# Altium project V2.3SB_Chipsat_Mark.PrjPcb
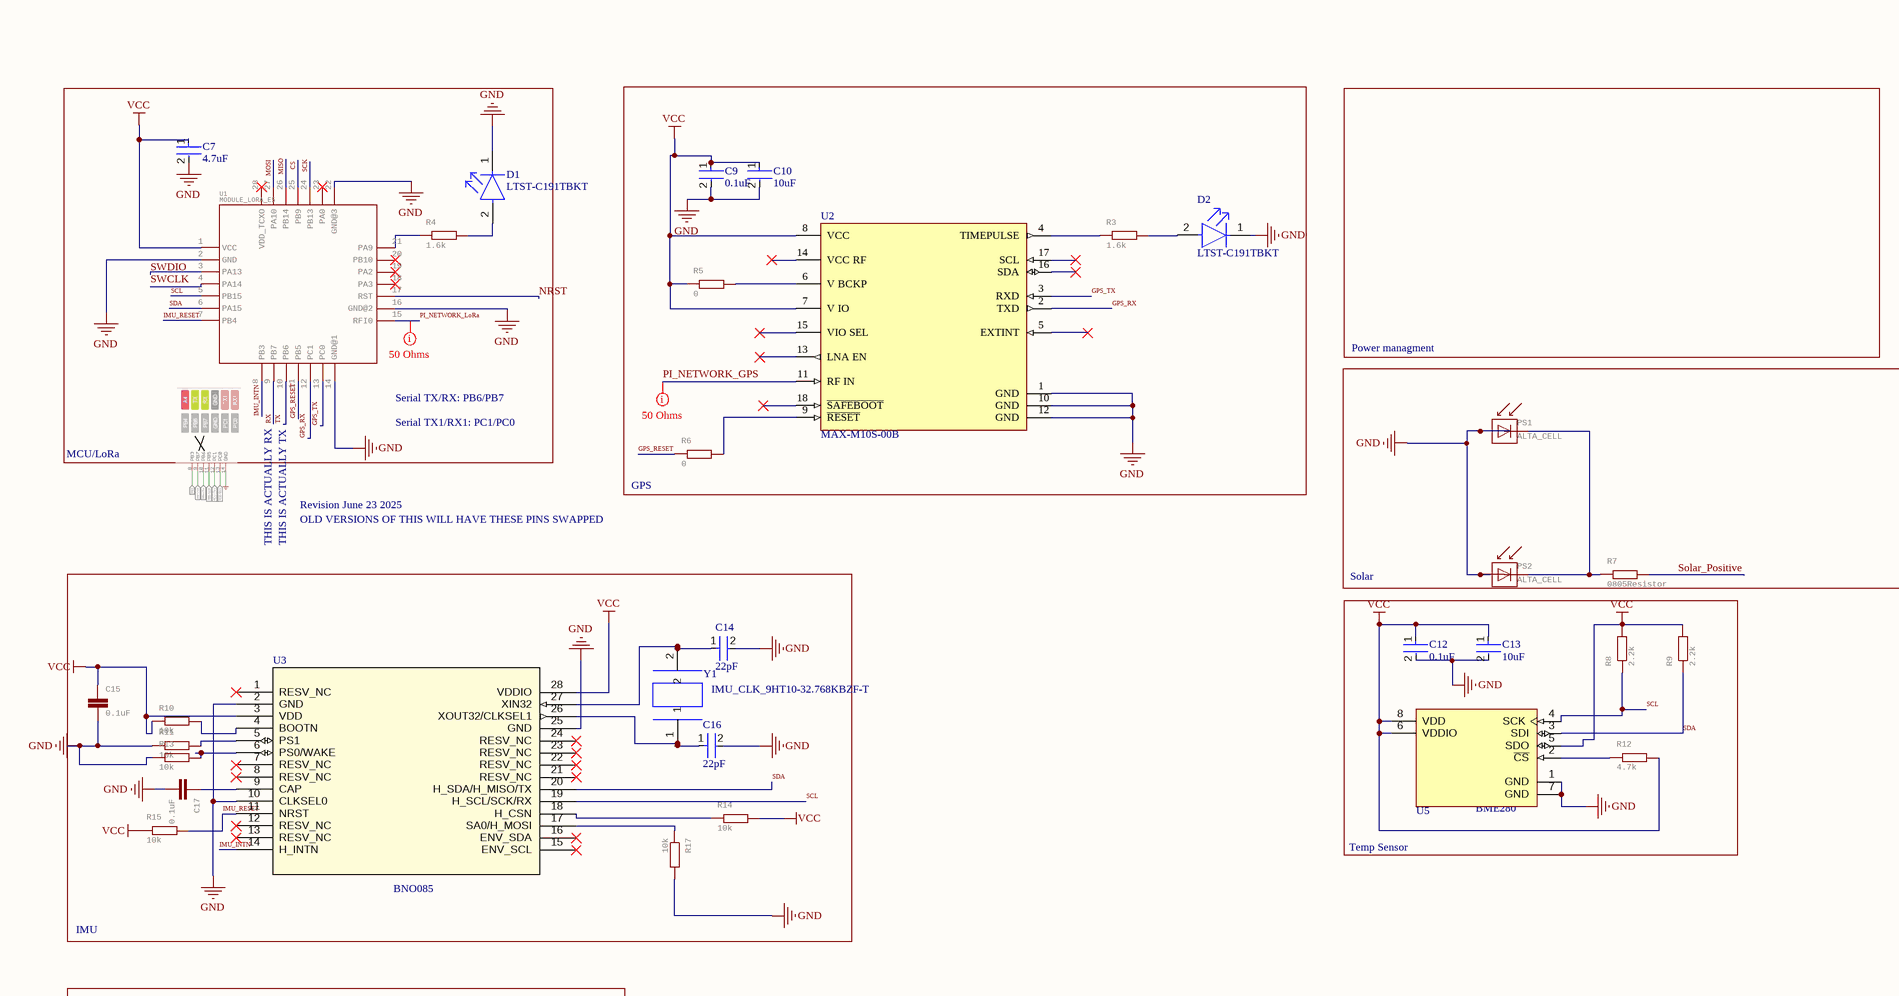
[diagram p0: V2.3SB.SchDoc, top left]
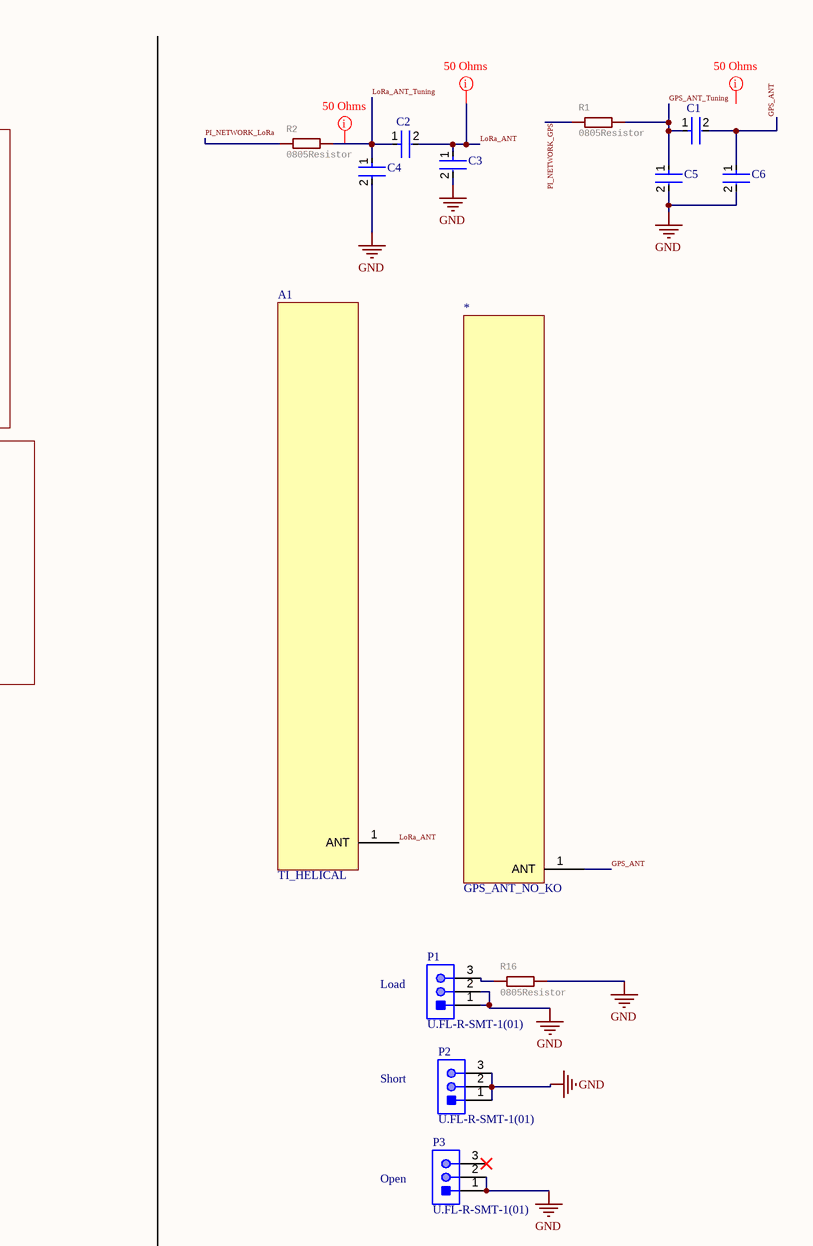
[diagram p1: V2.3SB.SchDoc, top right]
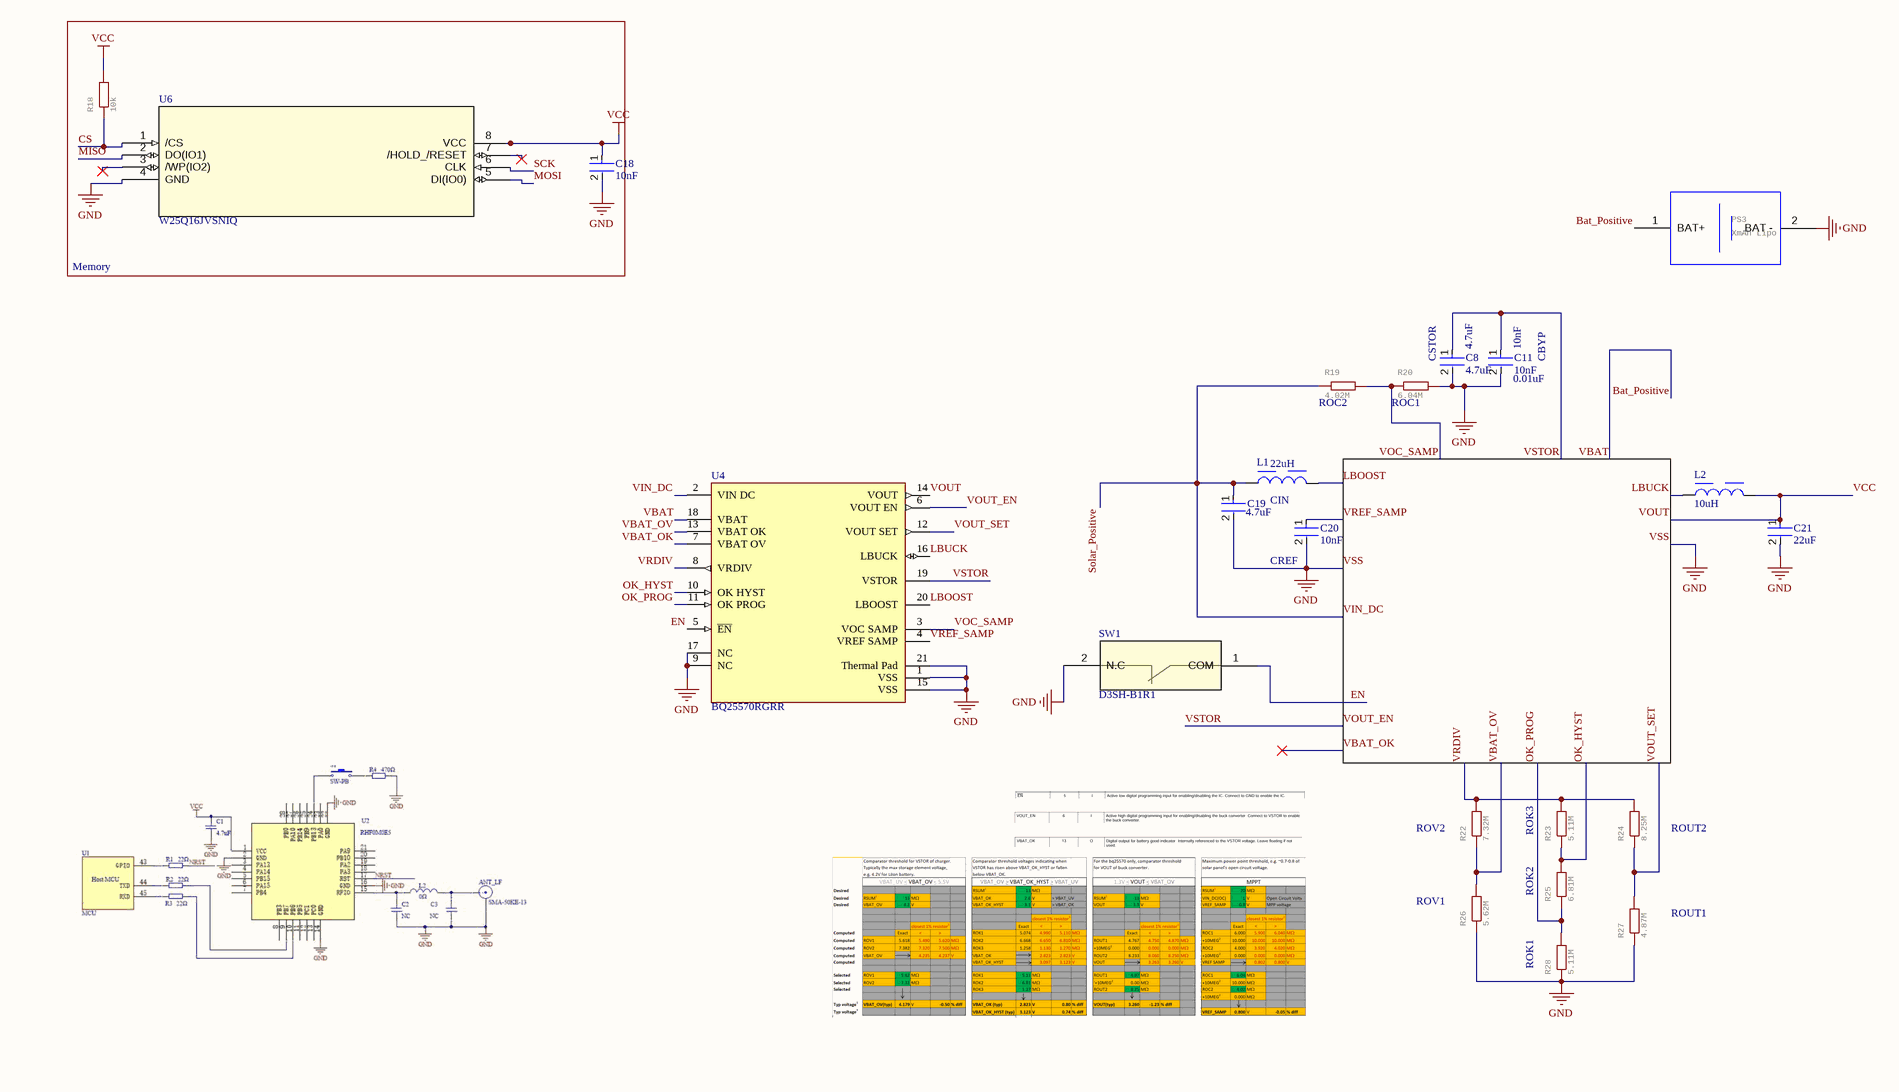
[diagram p2: V2.3SB.SchDoc, bottom left]
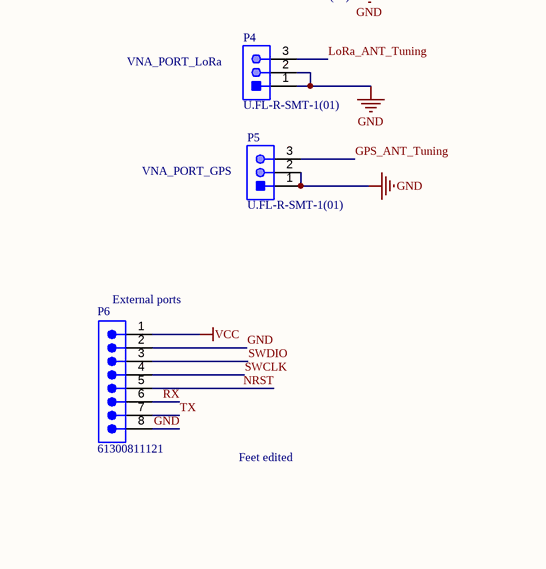
[diagram p3: V2.3SB.SchDoc, bottom right]
1 sheet, 71 parts. Net scope: global (net labels, ports and power ports of the same name join across sheets).
Board file: V2.3SB.PcbDoc

## Sheet V2.3SB.SchDoc
size 558 x 431 mm; SheetNumber: 1; SheetTotal: 1

### Parts
*  GPS_ANT_NO_KO  [GPS_ANT_NO_KO]
A1  TI_HELICAL  [TI_HELICAL]
C1  C0402C223K8PACTU  [PI_NET_CAPACITOR_0805]  (value not drawn)
C2  C0402C223K8PACTU  [PI_NET_CAPACITOR_0805]  (value not drawn)
C3  C0402C223K8PACTU  [PI_NET_CAPACITOR_0805]  (value not drawn)
C4  C0402C223K8PACTU  [PI_NET_CAPACITOR_0805]  (value not drawn)
C5  C0402C223K8PACTU  [PI_NET_CAPACITOR_0805]  (value not drawn)
C6  C0402C223K8PACTU  [PI_NET_CAPACITOR_0805]  (value not drawn)
C7  4.7uF  [0402CAP]
C8  4.7uF  [0402CAP]
C9  0.1uF  [0402CAP]
C10  10uF  [0402CAP]
C11  10nF  [0402CAP]
C12  0.1uF  [0402CAP]
C13  10uF  [0402CAP]
C14  22pF  [0402CAP]
C15  0.1uF  [0402]
C16  22pF  [0402CAP]
C17  0.1uF  [0402]
C18  10nF  [0402CAP]
C19  4.7uF  [0402CAP]  (value not drawn)
C20  10nF  [0402CAP]
C21  22uF  [0402CAP]
D1  LTST-C191TBKT  [0805LED]
D2  LTST-C191TBKT  [0805LED]
L1  22uH  [Inductor_Boost_BQ25570]
L2  10uH  [Inductor_Buck_BQ25570]
P1  U.FL-R-SMT-1(01)  [UFL]
P2  U.FL-R-SMT-1(01)  [UFL]
P3  U.FL-R-SMT-1(01)  [UFL]
P4  U.FL-R-SMT-1(01)  [UFL]
P5  U.FL-R-SMT-1(01)  [UFL]
P6  61300811121  [8pinhead Slightly wider]
PS1  ALTA_CELL  [ALTA_CELL_SAME_SIZED_FEET_SLIM]
PS2  ALTA_CELL  [ALTA_CELL_SAME_SIZED_FEET_SLIM]
PS3  XmAh Lipo  [BAT_PADS]
R1  0805Resistor  [0805Res]
R2  0805Resistor  [0805Res]
R3  1.6k  [0402]
R4  1.6k  [0402]
R5  0  [0402]
R6  0  [0402]
R7  0805Resistor  [0805Res]
R8  2.2k  [0402]
R9  2.2k  [0402]
R10  10k  [0402]
R11  10k  [0402]
R12  4.7k  [0402]
R13  10k  [0402]
R14  10k  [0402]
R15  10k  [0402]
R16  0805Resistor  [0805Res]
R17  10k  [0402]
R18  10k  [0402]
R19  4.02M  [0402]
R20  6.04M  [0402]
R22  7.32M  [0402]
R23  5.11M  [0402]
R24  8.25M  [0402]
R25  6.81M  [0402]
R26  5.62M  [0402]
R27  4.87M  [0402]
R28  5.11M  [0402]
SW1  D3SH-B1R1  [Micro_Trigger_Switch_Long_D3SH-B1R1]
U1  MODULE_LORA_E5  [MODULE28P-1-25-12X12X2-5MM]
U2  MAX-M10S-00B  [GPS_MAX_10]
U3  BNO085  [QFN28_BNO086_CEV]
U4  BQ25570RGRR  [BQ25570_With_Vias]
U5  BME280  [FP-BME280-MFG]  (value not drawn)
U6  W25Q16JVSNIQ  [SOIC_150MIL_WIN]
Y1  IMU_CLK_9HT10-32.768KBZF-T  [IMU_CLK_XTAL320X150X75]

### Blocks framed on the sheet
GPS: C9 C10 D2 R3 R5 R6 U2
IMU: C14-C17 R10 R11 R13-R15 R17 U3 Y1
Memory: C18 R18 U6

### Nets
GND: C3.2 C4.2 C5.2 C6.2 C7.2 C8.2 C9.2 C10.2 C11.2 C12.2 C13.2 C14.2 C15.2 C16.2 C17.2 C18.2 C19.2 C20.2 C21.2 D1.1(C) D2.1(C) P1.1 P1.2 P2.1 P2.2 P2.3 P3.1 P3.2 P4.1 P4.2 P5.1 P5.2 P6.2 P6.8 PS1.- PS2.- PS3.2(BAT_-) R11.1 R13.1 R16.2 R17.2 R20.2 R26.1 R27.1 R28.1 SW1.2(N.C) U1.2(GND) U1.14(GND@1) U1.16(GND@2) U1.22(GND@3) U2.1(GND) U2.10(GND) U2.12(GND) U3.2(GND) U3.10(CLKSEL0) U3.25(GND) U4.1(VSS) U4.9(NC) U4.15(VSS) U4.17(NC) U4.21(Thermal_Pad) U5.1(GND) U5.7(GND) U6.4(GND)  [also labelled VSS]
VCC: C7.1 C9.1 C10.1 C12.1 C13.1 C15.1 C18.1 C21.1 L2.2 P6.1 R5.1 R8.2 R9.2 R10.1 R12.2 R14.2 R15.1 R18.2 U1.1(VCC) U2.7(V_IO) U2.8(VCC) U3.3(VDD) U3.28(VDDIO) U4.14(VOUT) U5.5(SDO) U5.6(VDDIO) U5.8(VDD) U6.8(VCC)  [also labelled VOUT]
Bat_Positive: PS3.1(BAT+) U4.18(VBAT)  [also labelled VBAT]
CS: R18.1 U1.25(PB9) U6.1(/CS)
EN: SW1.1(COM) U4.5(~{EN})
GPS_ANT: *.1(ANT) C1.2 C6.1
GPS_ANT_Tuning: C1.1 C5.1 P5.3 R1.2
GPS_RESET: R6.1 U1.11(PB5)
GPS_RX: U1.12(PC1) U2.2(TXD)
GPS_TX: U1.13(PC0) U2.3(RXD)
IMU_INTN: U1.8(PB3) U3.14(H_INTN)
IMU_RESET: R15.2 U1.7(PB4) U3.11(NRST)
LBOOST: L1.2 U4.20(LBOOST)
LBUCK: L2.1 U4.16(LBUCK)
LoRa_ANT: A1.1(ANT) C2.2 C3.1
LoRa_ANT_Tuning: C2.1 C4.1 P4.3 R2.2
MISO: U1.26(PB14) U6.2(DO(IO1))
MOSI: U1.27(PA10) U6.5(DI(IO0))
NRST: P6.5 U1.17(RST)
OK_HYST: R23.1 R25.2 U4.10(OK_HYST)
OK_PROG: R25.1 R28.2 U4.11(OK_PROG)
PI_NETWORK_GPS: R1.1 U2.11(RF_IN)
PI_NETWORK_LoRa: R2.1 U1.15(RFI0)
RX: P6.6 U1.9(PB7)
SCK: U1.24(PB13) U6.6(CLK)
SCL: R8.1 U1.5(PB15) U3.19(H_SCL/SCK/RX) U5.4(SCK)
SDA: R9.1 U1.6(PA15) U3.20(H_SDA/H_MISO/TX) U5.3(SDI)
Solar_Positive: C19.1 L1.1 R7.2 R19.1 U4.2(VIN_DC)  [also labelled VIN_DC]
SWCLK: P6.4 U1.4(PA14)
SWDIO: P6.3 U1.3(PA13)
TX: P6.7 U1.10(PB6)
VBAT_OK: U4.7(VBAT_OV)
VBAT_OV: R22.1 R26.2 U4.13(VBAT_OK)
VOC_SAMP: R19.2 R20.1 U4.3(VOC_SAMP)
VOUT_EN: C8.1 C11.1 U4.6(VOUT_EN) U4.19(VSTOR)  [also labelled VSTOR]
VOUT_SET: R24.1 R27.2 U4.12(VOUT_SET)
VRDIV: R22.2 R23.2 R24.2 U4.8(VRDIV)
VREF_SAMP: C20.1 U4.4(VREF_SAMP)
NetC14_1: C14.1 U3.27(XIN32) Y1.2
NetC16_1: C16.1 U3.26(XOUT32/CLKSEL1) Y1.1
NetC17_1: C17.1 U3.9(CAP)
NetD1_2: D1.2(A) R4.2
NetD2_2: D2.2(A) R3.2
NetP1_3: P1.3 R16.1
NetPS1_+: PS1.+ PS2.+ R7.1
NetR3_1: R3.1 U2.4(TIMEPULSE)
NetR4_1: R4.1 U1.21(PA9)
NetR5_2: R5.2 U2.6(V_BCKP)
NetR6_2: R6.2 U2.9(~{RESET})
NetR10_2: R10.2 U3.4(BOOTN)
NetR11_2: R11.2 U3.5(PS1)
NetR12_1: R12.1 U5.2(~{CS})
NetR13_2: R13.2 U3.6(PS0/WAKE)
NetR14_1: R14.1 U3.18(H_CSN)
NetR17_1: R17.1 U3.17(SA0/H_MOSI)

Not connected (* = marked no-connect by the designer): P3 3*; U1 18(PA3)* 19(PA2)* 20(PB10)* 23(PA0)* 28(VDD_TCXO)*; U2 5(EXTINT)* 13(LNA_EN)* 14(VCC_RF)* 15(VIO_SEL)* 16(SDA)* 17(SCL)* 18(~{SAFEBOOT})*; U3 1(RESV_NC)* 7(RESV_NC)* 8(RESV_NC)* 12(RESV_NC)* 13(RESV_NC)* 15(ENV_SCL)* 16(ENV_SDA)* 21(RESV_NC)* 22(RESV_NC)* 23(RESV_NC)* 24(RESV_NC)*; U6 3(/WP(IO2))* 7(/HOLD_/RESET)*

### Layout directives
rule Impedance Constraint [Min = 49.00    Max = 51.00    ]: (no net found under the mark), LoRa_ANT, LoRa_ANT_Tuning, PI_NETWORK_GPS, PI_NETWORK_LoRa

### Notes on the sheet
- Power managment
- (near U1) Serial TX/RX: PB6/PB7
- MCU/LoRa
- Serial TX1/RX1: PC1/PC0
- OLD VERSIONS OF THIS WILL HAVE THESE PINS SWAPPED
- Revision June 23 2025
- THIS IS ACTUALLY RX
- THIS IS ACTUALLY TX
- Solar
- (near U5) BME280
- Temp Sensor
- (near P1) Load
- Short
- Open
- VNA_PORT_LoRa
- VNA_PORT_GPS
- (near C8) CSTOR
- 4.7uF
- (near C11) 10nF
- (near C11) CBYP
- (near R19) ROC2
- (near R20) ROC1
- (near C11) 0.01uF
- (near P6) External ports
- (near C19) 4.7uF
- (near L1) CIN
- Feet edited
- (near C20) CREF
- (near R22) ROV2
- (near R23) ROK3
- (near R24) ROUT2
- (near R26) ROV1
- (near R25) ROK2
- (near R28) ROK1
- (near R27) ROUT1
- DWG. NO.
- REV.
- SHT.
- REVISION
- DESCRIPTION
- DATE
- APPROVED
- THIS DOCUMENT AND THE DATA DISCLOSED HEREIN OR HEREWITH IS THE PROPERTY OF ALTIUM LIMITED AND MAY BE FREELY DISTRIBUTED IN WHOLE. NO RIGHTS ARE RESERVED OR EXPRESS OR IMPLIED WARANTEE GIVEN.
- ENG:
- DSN:
- APPROVALS
- PROJECT
- DOCUMENT REVISION:
- DESIGN ITEM:
- CHK:
- BOM:
- REFERENCE DOCUMENTS
- PROJECT REVISION:
- TITLE
- FAB DWG:
- PCB DWG:
- ASSY DWG:
- SCALE:
- SIZE
- C
- CAGE CODE
- FILE NAME
- DWG NO.
- SHEET
- OF
- REV

### Library data of the parts
* = GPS_ANT_NO_KO: helical_antenna schematic for the DeSCENT v1 ChipSat
A1 = TI_HELICAL: helical_antenna schematic for the DeSCENT v1 ChipSat
C1-C6 = 0805RFCapacitor_NO_SILK: CAP0805; Manufacturer: Kemet; Capacitance: 22,000 pF; Value: 22,000 pF; Temperature Coefficient: 15%; Material: Ceramic; Voltage Rating: 10 V; Temperature Characteristic: X5R; Tolerance: 0.1; RoHS: TRUE; Octopart: https://octopart.com/c0402c223k8pactu-kemet-140074; Category: Cap; Manufacturer Part Number: C0402C223K8PACTU; Lead Free: Yes; Automotive: No; Height: 0.55mm; Ipc Land Pattern Name: CAPC10050X50; ComponentLink2URL: https://content.kemet.com/datasheets/KEM_C1002_X7R_SMD.pdf; Device Class L2: Capacitors; Temperature Range Low: -55°C; ComponentLink2Description: Datasheet; Mouser Description: Multilayer Ceramic Capacitors MLCC - SMD/SMT 10volts 22000pF X5R 10%; Device Class L3: Ceramic Capacitors; Package: C0402-BB; Digikey Description: CAP CER 0.022UF 10V X5R 0402; Temperature: -55°C to +125°C; Device Class L1: Passive Components; Temperature Range High: +125°C
C7-C14 C16 C18-C21 = 0402Capacitor: Manufacturer Part Number: C0402C223K8PACTU; Manufacturer: Kemet; Capacitance: 22,000 pF; Value: 22,000 pF; Temperature Coefficient: 15%; Material: Ceramic; Voltage Rating: 10 V; Temperature Characteristic: X5R; Tolerance: 0.1; RoHS: TRUE; Octopart: https://octopart.com/c0402c223k8pactu-kemet-140074; Category: Cap; Lead Free: Yes; Automotive: No; Height: 0.55mm; Ipc Land Pattern Name: CAPC10050X50; ComponentLink2URL: https://content.kemet.com/datasheets/KEM_C1002_X7R_SMD.pdf; Device Class L2: Capacitors; Temperature Range Low: -55°C; ComponentLink2Description: Datasheet; Mouser Description: Multilayer Ceramic Capacitors MLCC - SMD/SMT 10volts 22000pF X5R 10%; Device Class L3: Ceramic Capacitors; Package: C0402-BB; Digikey Description: CAP CER 0.022UF 10V X5R 0402; Temperature: -55°C to +125°C; Device Class L1: Passive Components; Temperature Range High: +125°C
C15 C17 = C-EUC0805K: CAPACITOR, European symbol; GateName_1: G$1; SymbolName_1: C-EU; DeviceName: C0805K; LibraryName: rcl; DeviceSetName: C-EU
D1 D2 = 0805LED: LED BLUE CLEAR CHIP SMD; Lens Color: Colorless; Dominant Wavelength: 475nm; Forward Current: 20mA; Wavelength: 468nm; Viewing Angle: 130°; Power Dissipation: 76mW; Luminous Intensity: 180mcd; Reverse Voltage: 5V; Number of Elements: 1; Lens Style: Diffused; Forward Voltage: 3.8V; Max Power Dissipation: 75mW; Case Code (Metric): 1608; Packaging: Tape and Reel; Case/Package: 0603; Depth: 1.6mm; Mount: Surface Mount; Lead Free: Lead Free; Min Operating Temperature: -20°C; Lens Transparency: Clear; Illumination Color: Blue; Height: 0.55mm; Test Current: 20mA; Case Code (Imperial): 0603; Max Operating Temperature: 80°C; Number of Pins: 2; Length: 0.8mm; Radiation Hardening: No; Package Quantity: 1; Number of LEDs: 1; Width: 0.8mm; Color: Blue
L1 = Inductor_Boost_BQ25570: 744031220; NexarPartId: 22866169; Series Resistance: 450mΩ; Self Resonant Frequency: 26MHz; Core Material: Ferrite; Current Rating: 510mA; Test Frequency: 100kHz; Tolerance: 30%; Saturation Current: 360mA; Inductance: 22µH; DC Resistance (DCR): 410mΩ; Width: 3.8mm; Ambient Temperature Range High: 95°C; Number of Pins: 2; Ambient Temperature Range Low: -40°C; Min Operating Temperature: -40°C; Packaging: Tape & Reel (TR); Height: 1.65mm; RoHS: Compliant; Composition: Wirewound; RMS Current (Irms): 510mA; Max Operating Temperature: 125°C; Inductance Tolerance: 30%; Length: 3.8mm
L2 = Inductor_Buck_BQ25570: 744029100; NexarPartId: 8917062; Tolerance: 30%; Saturation Current: 500mA; Series Resistance: 300mΩ; Shielding: Shielded; Core Material: Ferrite; Resistance: 390mΩ; Max DC Current: 800mA; Inductance: 10µH; Self Resonant Frequency: 40MHz; Test Frequency: 100kHz; RMS Current (Irms): 650mA; Min Operating Temperature: -40°C; Mount: Surface Mount; Height - Seated (Max): 1.4986mm; Width: 2.78mm; Number of Pins: 2; Ambient Temperature Range High: 85°C; Lead Free: Lead Free; Case/Package: Nonstandard; Weight: 32.006612mg; REACH SVHC: Unknown; Depth: 2.8mm; Height: 1.35mm; Length: 2.78mm; RoHS: Compliant; Max Operating Temperature: 125°C; DC Resistance (DCR): 390mΩ; Inductance Tolerance: 30%; Composition: Wirewound; Current Rating: 650mA; Ambient Temperature Range Low: -40°C; Termination: SMD/SMT; Packaging: Cut Tape (CT)
P1-P5 = UFL: Ultra Small Coaxial Connector, 6 GHz, -40 to 90 degC, 3-Pin SMD, RoHS, Bulk; Manufacturer: Hirose Electric; Connector Style: U.FL; Impedance: 50Ohm; Dielectric Material: LiquidCrystalPolymer(LCP); Minimum Quantity: UltraMiniatureCoaxial; Online Catalog: U.FLSeries; Featured Product: HiroseU.FLSeries; Frequency - Max: 6GHz; Other Names: H122041 / U.FL-R-SMT-1(01)-ND; Contact Termination: Solder; Body Material: PhosphorBronze; Connector Type: Jack,MalePin; Body Finish: Silver; Center Contact Plating: Gold; Manufacturer URL: https://www.hirose.com; Family: CoaxialConnectors(RF); Fastening Type: Snap-On; Unit PriceUSD: U.FL; Series: U.FL; Package Reference: U.FL-R-SMT; Packaging: Bulk; Standard Package: 100; Mounting Type: SurfaceMount; Quantity Available: Bulk; Housing Color: Silver; Package Description: 3-Pin Surface Mount Device, Body 2.6 x 2.6 mm; Category: Connectors,Interconnects; Operating Temperature: -40degC~90degC; Center Contact Material: PhosphorBronze; Dynamic Catalog: U.FLSeries; Datasheet URL: https://datasheet.ciiva.com/26945/getdatasheetpartid-475239-26945414.pdf; Datasheet Version: Feb-09; Shield Termination: Solder
P6 = 8pinhead: NexarPartId: 32855533; Connector Type: Male Pin; Number of Contacts: 8; Voltage Rating: 250V; Current Rating: 3A; Contact Resistance: 20mΩ; Pitch: 2.54mm; Gender: Male; Termination: Solder; Contact Material: Copper; Mount: Through Hole; Lead Pitch: 2.54mm; Number of Positions: 8; Operating Supply Voltage: 250V; Number of Pins: 8; Max Operating Temperature: 105°C; Height: 8.54mm; REACH SVHC: Unknown; Number of Rows: 1; Packaging: Bulk; Contact Plating: Gold; Contact Mating Length: 5.9944mm; Orientation: Vertical; RoHS: Compliant; Color: Black; Min Operating Temperature: -40°C
PS1 PS2 = ALTA_CELL_RESIZED_SLIM: No SILK; GateName_1: G$1; SymbolName_1: ALTA_CELL; LibraryName: ALTA_CELL; DeviceSetName: ALTA_CELL
PS3 = BAT_PADS: No SILK; GateName_1: G$1; SymbolName_1: ALTA_CELL; LibraryName: ALTA_CELL; DeviceSetName: ALTA_CELL
R1 R2 R7 R16 = 0805Resistor: RESISTOR, European symbol; GateName_1: G$1; SymbolName_1: R-EU; DeviceName: M0805; DeviceSetName: R-EU_; LibraryName: rcl
R3-R6 R8-R15 R17-R20 R22-R28 = 0402Resistor: RESISTOR, European symbol; GateName_1: G$1; SymbolName_1: R-EU; DeviceName: M0805; DeviceSetName: R-EU_; LibraryName: rcl
SW1 = Micro_Trigger_Switch_Long_D3SH-B1R1: Manufacturer_Name: Omron; Copyright: Copyright (C) 2025 Ultra Librarian. All rights reserved.; Manufacturer_Part_Number: D3SH-B1R1; RefDes: RefDes; Type: Type
U1 = MODULE_LORA_E5: GateName_1: G$1; SymbolName_1: MOUDLE_LORA_E5; LibraryName: LORA-E5_Eagle_Library; DeviceSetName: MODULE_LORA_E5; Package: MODULE28P-1.25-12X12X2.5MM
U2 = GPS_MAX_10: GNSS LCC RX, ROM, TCXO, LNA, SAW
U3 = BNO086: No Description Available; Mfr_Name: CEVA; Type: Motion Sensors; RefDes: RefDes
U4 = BQ25570_With_Vias: IC ENERGY HARV CTRLR BATT 20VQFN; Operating Supply Current: 488nA; Switching Frequency: 1MHz; Operating Supply Voltage: 4V; Output Current: 100mA; Packaging: Tape and Reel; Lead Free: Lead Free; Contact Plating: Gold; RoHS Compliant: Yes; Mount: Surface Mount; Case/Package: VQFN; Min Operating Temperature: -40°C; Max Operating Temperature: 125°C; Package Quantity: 3000; Number of Pins: 20
U5 = BME280: Temp and huminity sensor
U6 = W25Q16JVSNIQ: No Description Available; Mfr_Name: Winbond; RefDes: RefDes; Type: Type
Y1 = IMU_CLK_9HT10-32.768KBZF-T: 32.768 kHz Â±50ppm Crystal 12.5pF 70 kOhms 2-SMD, No Lead; MF: TXC; SnapEDA_Link: https://www.snapeda.com/parts/9HT10-32.768KBZF-T/TXC/view-part/?ref=snap; Package: SMD-2 TXC Corporation; Value: *; MP: 9HT10-32.768KBZF-T; Check_prices: https://www.snapeda.com/parts/9HT10-32.768KBZF-T/TXC/view-part/?ref=eda